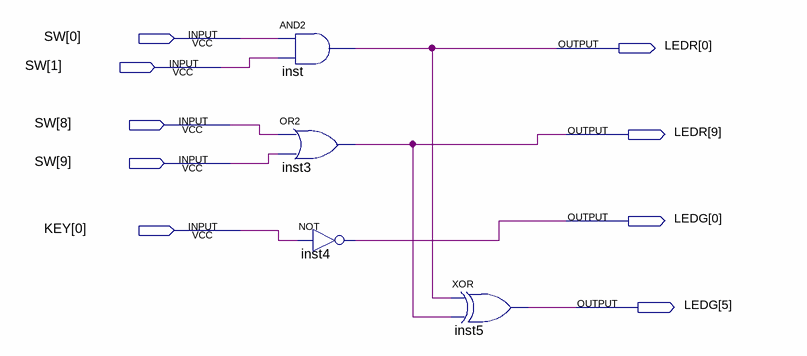
[diagram p0: schematic sheet]
// Quartus schematic Simple_circuit_schematic_entry.bdf as structural Verilog: 4 symbols, 9 pins
module Simple_circuit_schematic_entry (
  input  [9:0] SW,
  input  [0:0] KEY,
  output [9:0] LEDR,
  output [5:0] LEDG
);

  and inst (LEDR[0], SW[0], SW[1]);
  or inst3 (LEDR[9], SW[8], SW[9]);
  not inst4 (LEDG[0], KEY[0]);
  xor inst5 (LEDG[5], LEDR[0], LEDR[9]);
endmodule
